# Altium schematic sheet Sheet2.SchDoc: ESP32 ESP Home Template
size A4; DrawnBy: Tim Baker; Revision: 1; SheetNumber: 1; SheetTotal: 5